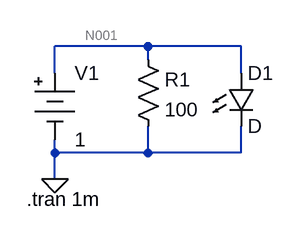
[diagram p0: schematic D-34_MISC-1_v-1-0_e-1a.asc]
D-34_MISC-1_v-1-0_e-1a.asc, the LTspice schematic file:
Version 4
SHEET 1 880 680
WIRE 128 64 16 64
WIRE 240 64 128 64
WIRE 128 80 128 64
WIRE 16 96 16 64
WIRE 240 96 240 64
WIRE 16 192 16 176
WIRE 128 192 128 160
WIRE 128 192 16 192
WIRE 240 192 240 160
WIRE 240 192 128 192
WIRE 16 224 16 192
FLAG 16 224 0
SYMBOL Misc\\battery 16 80 R0
SYMATTR InstName V1
SYMATTR Value 1
SYMBOL LED 224 96 R0
SYMATTR InstName D1
SYMBOL res 112 64 R0
SYMATTR InstName R1
SYMATTR Value 100
TEXT -18 248 Left 2 !.tran 1m

The netlist it stands for:
* D-34_MISC-1_v-1-0_e-1a.asc
V1 N001 0 1
D1 N001 0 D
R1 N001 0 100
.model D D
.lib standard.dio
.tran 1m
.backanno
.end

* Results of the author's LTspice run, read from the files saved beside the schematic
* Operating Point, zero values left out:
*   V(n001) = 1 V
*   I(D1) = 617.8 A
*   I(R1) = 10 mA
*   I(V1) = -617.8 A